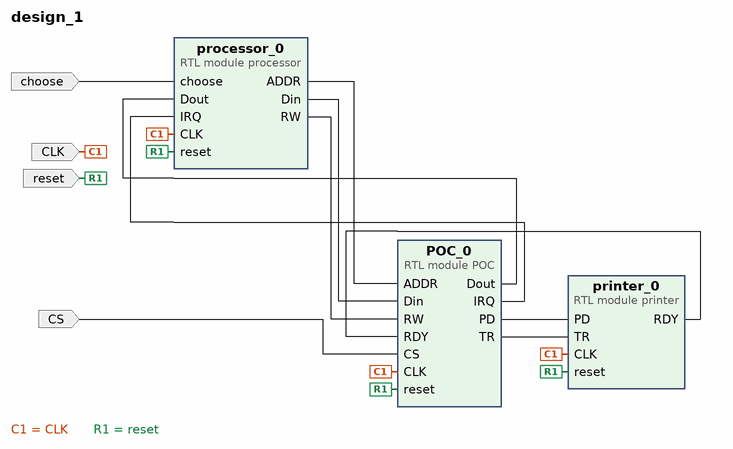
[diagram p0: block diagram of the top level]
# Vivado block design design_1, xc7a100tcsg324-1, Vivado 2018.2
create_bd_design design_1

create_bd_port -dir I CLK
create_bd_port -dir I reset
create_bd_port -dir I CS
create_bd_port -dir I choose

create_bd_cell -type module -reference POC POC_0
create_bd_cell -type module -reference printer printer_0
create_bd_cell -type module -reference processor processor_0

# ---- connections ----

connect_bd_net [get_bd_pins POC_0/PD] [get_bd_pins printer_0/PD]
connect_bd_net [get_bd_pins POC_0/Dout] [get_bd_pins processor_0/Dout]
connect_bd_net [get_bd_pins printer_0/RDY] [get_bd_pins POC_0/RDY]
connect_bd_net [get_bd_pins processor_0/ADDR] [get_bd_pins POC_0/ADDR]
connect_bd_net [get_bd_pins processor_0/Din] [get_bd_pins POC_0/Din]
connect_bd_net [get_bd_pins processor_0/RW] [get_bd_pins POC_0/RW]
connect_bd_net [get_bd_pins POC_0/TR] [get_bd_pins printer_0/TR]
connect_bd_net [get_bd_pins POC_0/IRQ] [get_bd_pins processor_0/IRQ]
connect_bd_net [get_bd_ports CLK] [get_bd_pins printer_0/CLK] [get_bd_pins processor_0/CLK] [get_bd_pins POC_0/CLK]
connect_bd_net [get_bd_ports CS] [get_bd_pins POC_0/CS]
connect_bd_net [get_bd_ports reset] [get_bd_pins printer_0/reset] [get_bd_pins processor_0/reset] [get_bd_pins POC_0/reset]
connect_bd_net [get_bd_ports choose] [get_bd_pins processor_0/choose]

validate_bd_design
save_bd_design
